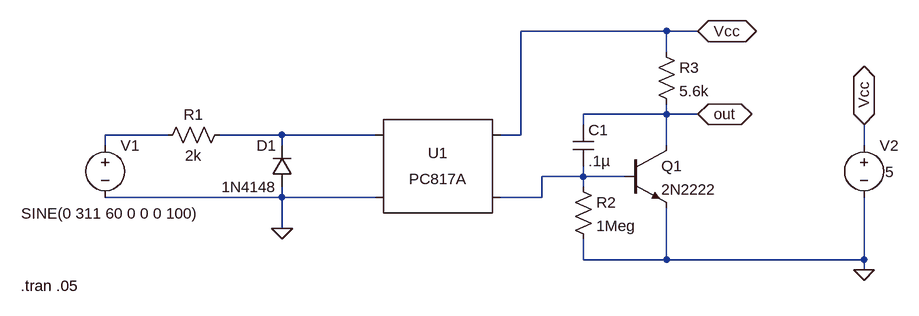
[diagram p0: schematic Voltage_measurement.asc]
Voltage_measurement.asc, the LTspice schematic file:
Version 4
SHEET 1 952 680
WIRE 576 -48 352 -48
WIRE 624 -48 576 -48
WIRE 576 -16 576 -48
WIRE 576 80 576 64
WIRE 576 80 448 80
WIRE 624 80 576 80
WIRE 448 96 448 80
WIRE -192 112 -288 112
WIRE -16 112 -112 112
WIRE 128 112 -16 112
WIRE 352 112 352 -48
WIRE 352 112 320 112
WIRE -288 128 -288 112
WIRE -16 128 -16 112
WIRE 576 128 576 80
WIRE 880 128 880 96
WIRE 448 176 448 160
WIRE 448 176 384 176
WIRE 512 176 448 176
WIRE 448 192 448 176
WIRE -16 208 -16 192
WIRE -16 208 -288 208
WIRE 128 208 -16 208
WIRE 384 208 384 176
WIRE 384 208 320 208
WIRE -16 256 -16 208
WIRE 448 304 448 272
WIRE 576 304 576 224
WIRE 576 304 448 304
WIRE 880 304 880 208
WIRE 880 304 576 304
WIRE 880 320 880 304
FLAG 624 -48 Vcc
IOPIN 624 -48 BiDir
FLAG 624 80 out
IOPIN 624 80 BiDir
FLAG 880 96 Vcc
IOPIN 880 96 BiDir
FLAG -16 256 0
FLAG 880 320 0
SYMBOL diode 0 192 R180
WINDOW 0 24 64 Left 2
WINDOW 3 24 0 Left 2
SYMATTR InstName D1
SYMATTR Value 1N4148
SYMBOL res -96 96 R90
WINDOW 0 0 56 VBottom 2
WINDOW 3 32 56 VTop 2
SYMATTR InstName R1
SYMATTR Value 2k
SYMBOL voltage -288 112 R0
WINDOW 3 -129 121 Left 2
WINDOW 123 0 0 Left 0
WINDOW 39 0 0 Left 0
SYMATTR InstName V1
SYMATTR Value SINE(0 311 60 0 0 0 100)
SYMBOL npn 512 128 R0
SYMATTR InstName Q1
SYMATTR Value 2N2222
SYMBOL res 432 176 R0
SYMATTR InstName R2
SYMATTR Value 1Meg
SYMBOL cap 432 96 R0
SYMATTR InstName C1
SYMATTR Value .1µ
SYMBOL res 560 -32 R0
SYMATTR InstName R3
SYMATTR Value 5.6k
SYMBOL voltage 880 112 R0
WINDOW 3 33 57 Left 2
SYMATTR InstName V2
SYMATTR Value 5
SYMBOL Optos\\PC817A 224 160 R0
SYMATTR InstName U1
TEXT -418 344 Left 2 !.tran .05

The netlist it stands for:
* Voltage_measurement.asc
D1 0 N002 1N4148
R1 N002 N001 2k
V1 N001 0 SINE(0 311 60 0 0 0 100)
Q1 out N003 0 0 2N2222
R2 N003 0 1Meg
C1 out N003 .1µ
R3 Vcc out 5.6k
V2 Vcc 0 5
XU1 N002 0 Vcc N003 PC817 Igain=1m
.model D D
.lib standard.dio
.model NPN NPN
.model PNP PNP
.lib standard.bjt
.tran .05
.lib PC817.sub
.backanno
.end